# Altium schematic sheet buck.SchDoc
size 297 x 209 mm
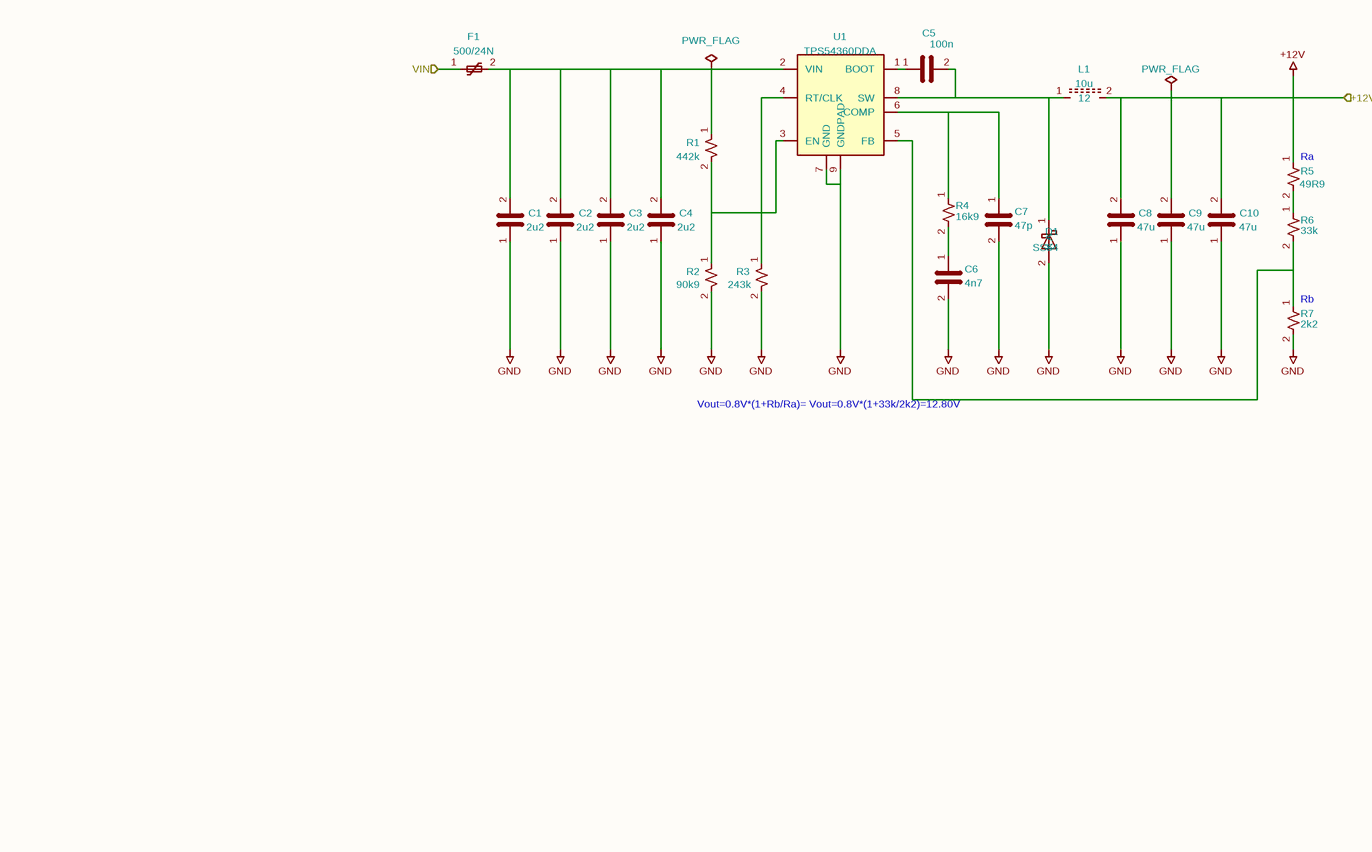
[diagram p0: buck.SchDoc]

## Parts
#FLG01  PWR_FLAG  (graphical)
#FLG02  PWR_FLAG  (graphical)
C1  2u2  [C_0603_1608Metric]
C2  2u2  [C_0603_1608Metric]
C3  2u2  [C_0603_1608Metric]
C4  2u2  [C_0603_1608Metric]
C5  100n  [C_0603_1608Metric]
C6  4n7  [C_0603_1608Metric]
C7  47p  [C_0603_1608Metric]
C8  47u  [C_0805_2012Metric]
C9  47u  [C_0805_2012Metric]
C10  47u  [C_0805_2012Metric]
D1  SS54  [D_SMC]
F1  500/24N  [Fuse_2920_7451Metric]
L1  10u  [L_Taiyo-Yuden_NR-60xx]
R1  442k  [R_0603_1608Metric]
R2  90k9  [R_0603_1608Metric]
R3  243k  [R_0603_1608Metric]
R4  16k9  [R_0603_1608Metric]
R5  49R9  [R_0603_1608Metric]
R6  33k  [R_0603_1608Metric]
R7  2k2  [R_0603_1608Metric]
U1  TPS54360DDA  [HSOP-8-1EP_3.9x4.9mm_P1.27mm_EP2.41x3.1mm_ThermalVias]

## Ports
+12V (in), VIN (in)

## Nets
+12V: #FLG02.1 C8.2 C9.2 C10.2 L1.2 R5.1 ; port +12V
GND: C1.1 C2.1 C3.1 C4.1 C6.2 C7.2 C8.1 C9.1 C10.1 D1.2(A) R2.2 R3.2 R7.2 U1.7(GND) U1.9(GNDPAD)
VIN: F1.1 ; port VIN
Net#FLG01_1: #FLG01.1 C1.2 C2.2 C3.2 C4.2 F1.2 R1.1 U1.2(VIN)
NetC5_1: C5.1 U1.1(BOOT)
NetC5_2: C5.2 D1.1(K) L1.1 U1.8(SW)
NetC6_1: C6.1 R4.2
NetC7_1: C7.1 R4.1 U1.6(COMP)
NetR1_2: R1.2 R2.1 U1.3(EN)
NetR3_1: R3.1 U1.4(RT/CLK)
NetR5_2: R5.2 R6.1
NetR6_2: R6.2 R7.1 U1.5(FB)

## Notes on the sheet
- (near R5) Ra
- (near R7) Rb
- Vout=0.8V*(1+Rb/Ra)=
  Vout=0.8V*(1+33k/2k2)=12.80V
- 1
- 2
- 3
- 4
- 5
- 6
- A
- B
- C
- D
- Title: UPS Lead Acid
- File: buck.kicad_sch
- Sheet: /
- Electgpl
- KiCad E.D.A.  kicad (5.1.4)-1
- Size: A4
- Date: 2025-06-05
- Rev: 1.0
- Id: 1/1

## Library data of the parts
#FLG01 #FLG02 = PWR_FLAG: Description: Special symbol for telling ERC where power comes from; Value: PWR_FLAG
C1-C4 = C: MFR P/N: CL10A225KB8NNNC; Description: Unpolarized capacitor; Absolute minimum: 100V; Reference MFG P/N: C6119935; LCSC: C913904; Value: 2u2; Footprint: Capacitor_SMD:C_0603_1608Metric
C5 = C: MFR P/N: CL10B104KB8NNNC; Description: Unpolarized capacitor; Absolute minimum: 50V; Reference MFG P/N: C5142567; LCSC: C1591; Value: 100n; Footprint: Capacitor_SMD:C_0603_1608Metric
C6 = C: MFR P/N: CL10B472KB8NNNC; Description: Unpolarized capacitor; Absolute minimum: 50V; Reference MFG P/N: C7503510; LCSC: C1621; Value: 4n7; Footprint: Capacitor_SMD:C_0603_1608Metric
C7 = C: MFR P/N: CL10C470JB8NNNC; Description: Unpolarized capacitor; Absolute minimum: 50V; Reference MFG P/N: C466230; LCSC: C1671; Value: 47p; Footprint: Capacitor_SMD:C_0603_1608Metric
C8-C10 = C: MFR P/N: CL21A226MAYNNNE; Description: Unpolarized capacitor; Absolute minimum: 10V; Reference MFG P/N: C19103846; LCSC: C602037; Value: 47u; Footprint: Capacitor_SMD:C_0805_2012Metric
D1 = B240: Description: 40V 2A Schottky Barrier Rectifier Diode, SMB; Absolute minimum: 40V 5A; Reference MFG P/N: C5200096; LCSC: C5199108; MFR P/N: SS54; Value: SS54; Footprint: Diode_SMD:D_SMC
F1 = Polyfuse_Small: MFR P/N: SMD2920-500/24N; Description: 24V 5A 40A 10A 2920 Resettable Fuses ROHS; Absolute minimum: 16V 3A; Reference MFG P/N: C6165172; LCSC: C6165172; Value: 500/24N; Footprint: Fuse:Fuse_2920_7451Metric
L1 = L_Ferrite: MFR P/N: VLS6045EX-100M; Description: Inductor with ferrite core; Absolute minimum: 5A; Reference MFG P/N: C2849537; LCSC: C360734; Value: 10u; Footprint: Inductor_SMD:L_Taiyo-Yuden_NR-60xx
R1 = R_Small_US: MFR P/N: 0603WAF4423T5E; Description: Resistor, small US symbol; Absolute minimum: 442k 0402; Reference MFG P/N: C3016035; LCSC: C23175; Value: 442k; Footprint: Resistor_SMD:R_0603_1608Metric
R2 = R_Small_US: MFR P/N: FRC0603F9092TS; Description: Resistor, small US symbol; Absolute minimum: 90k9 0402; Reference MFG P/N: C26989; LCSC: C2930136; Value: 90k9; Footprint: Resistor_SMD:R_0603_1608Metric
R3 = R_Small_US: MFR P/N: FRC0603F2433TS; Description: Resistor, small US symbol; Absolute minimum: 243k 0402; Reference MFG P/N: C2998149; LCSC: C7467321; Value: 243k; Footprint: Resistor_SMD:R_0603_1608Metric
R4 = R_Small_US: MFR P/N: FRC0603F1692TS; Description: Resistor, small US symbol; Absolute minimum: 16k9 0402; Reference MFG P/N: C2929989; LCSC: C2933158; Value: 16k9; Footprint: Resistor_SMD:R_0603_1608Metric
R5 = R_Small_US: MFR P/N: FRC0603F49R9TS; Description: Resistor, small US symbol; Absolute minimum: 49R9 0402; Reference MFG P/N: C25120; LCSC: C2930110; Value: 49R9; Footprint: Resistor_SMD:R_0603_1608Metric
R6 = R_Small_US: MFR P/N: FRC0603J333 TS; Description: Resistor, small US symbol; Absolute minimum: 53k6 0402; Reference MFG P/N: C5153961; LCSC: C2907153; Value: 33k; Footprint: Resistor_SMD:R_0603_1608Metric
R7 = R_Small_US: MFR P/N: FRC0603J222 TS; Description: Resistor, small US symbol; Absolute minimum: 10k2 0402; Reference MFG P/N: C3015976; LCSC: C2907117; Value: 2k2; Footprint: Resistor_SMD:R_0603_1608Metric
U1 = TPS54360DDA: MFR P/N: TPS54360DDAR; Description: 3.5A, Step Down DC-DC Converter with Eco-mode, 4.5-60V Input Voltage, PowerSO-8; Reference MFG P/N: C44377; Absolute minimum: TPS54360DDA; LCSC: C44377; Value: TPS54360DDA; Footprint: Package_SO:HSOP-8-1EP_3.9x4.9mm_P1.27mm_EP2.41x3.1mm_ThermalVias